# EAGLE design therma (EAGLE 9.1.0)
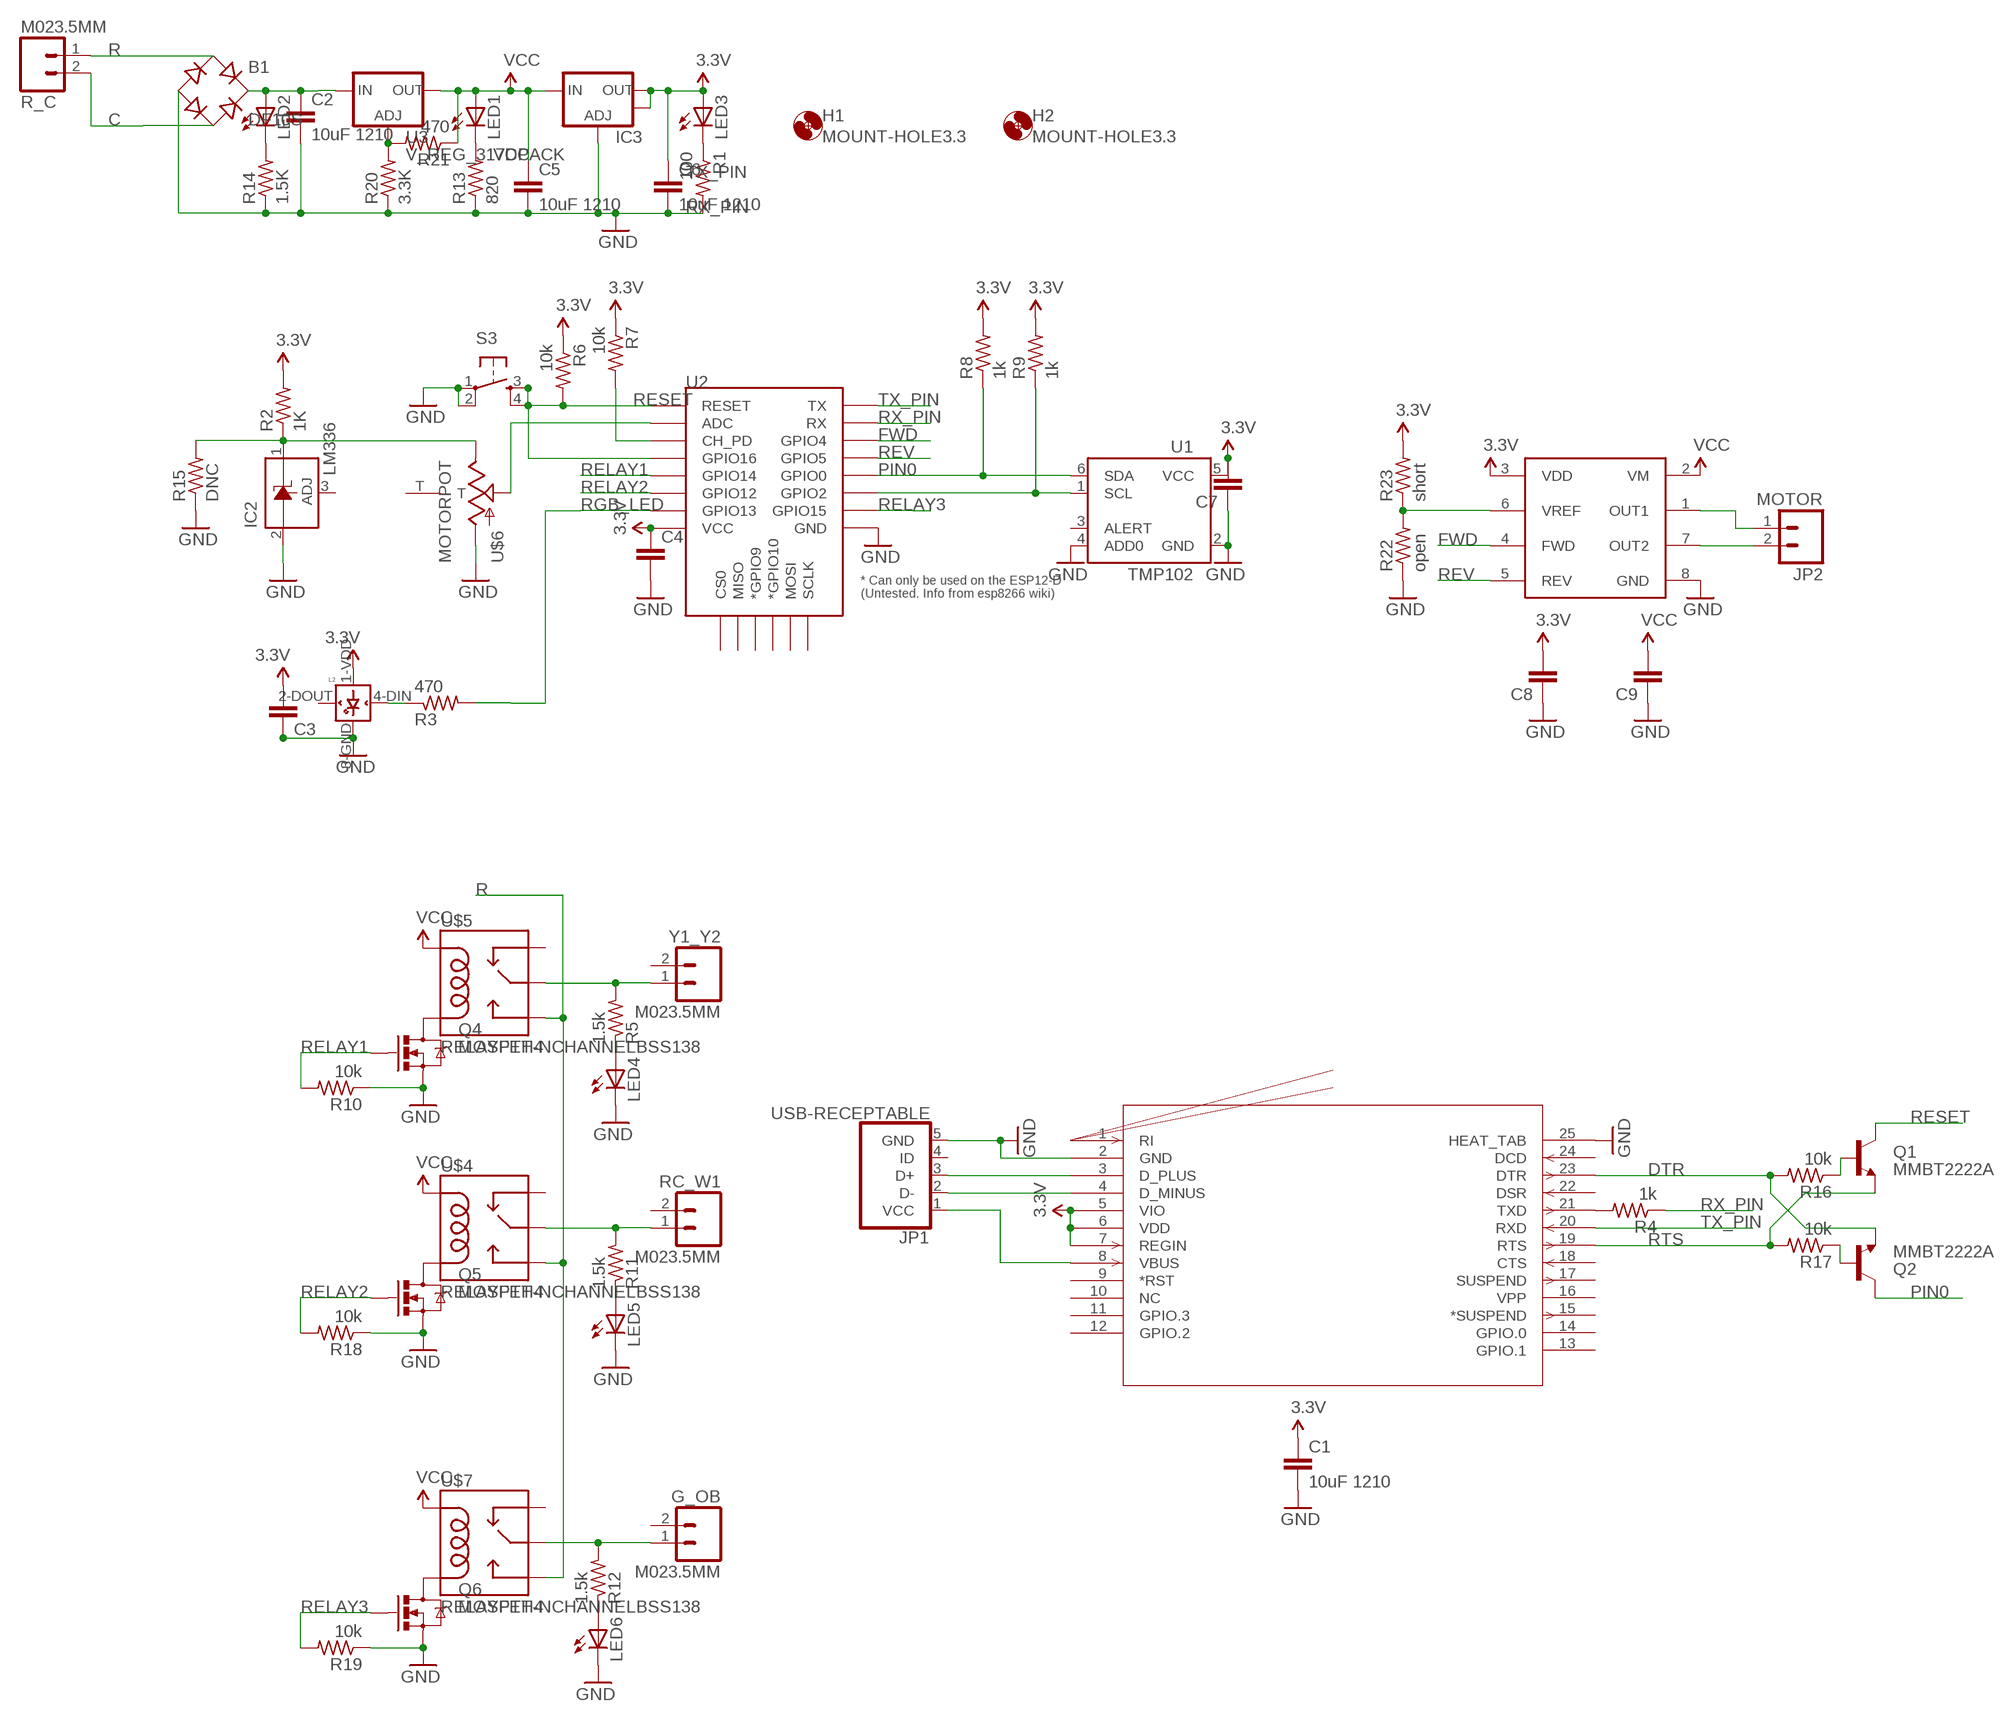
[diagram p0: schematic, sheet 1]

## Parts
B1  DF10S  [DFS]
C1  10uF 1210  10UF50V20%(1210)  [1210]
C2  10uF 1210  10UF50V20%(1210)  [1210]
C3  CAP0603-CAP  [0603-CAP]
C4  CAP0603-CAP  [0603-CAP]
C5  10uF 1210  10UF50V20%(1210)  [1210]
C6  10uF 1210  10UF50V20%(1210)  [1210]
C7  CAP0603-CAP  [0603-CAP]
C8  CAP0603-CAP  [0603-CAP]
C9  CAP0603-CAP  [0603-CAP]
G_OB  M023.5MM  [SCREWTERMINAL-3.5MM-2]
H1  MOUNT-HOLE3.3  [3,3]
H2  MOUNT-HOLE3.3  [3,3]
IC2  LM336  [SOT23-3]
IC3  V_REG_LM1117SOT223  [SOT223]
JP1  USB-RECEPTABLE  [FCI-10103594-0001LF]
JP2  MOTOR  M02PTH  [1X02]
L2  WS2812B  [WS2812B]
LED1  LEDCHIPLED_1206  [CHIPLED_1206]
LED2  LEDCHIPLED_1206  [CHIPLED_1206]
LED3  LEDCHIPLED_1206  [CHIPLED_1206]
LED4  LEDCHIPLED_1206  [CHIPLED_1206]
LED5  LEDCHIPLED_1206  [CHIPLED_1206]
LED6  LEDCHIPLED_1206  [CHIPLED_1206]
Q1  MMBT2222A  TRANSISTOR_NPNMMBT2222A  [SOT23]
Q2  MMBT2222A  TRANSISTOR_NPNMMBT2222A  [SOT23]
Q4  MOSFET-NCHANNELBSS138  [SOT23]
Q5  MOSFET-NCHANNELBSS138  [SOT23]
Q6  MOSFET-NCHANNELBSS138  [SOT23]
R1  100  R-US_R0603  [R0603]
R2  1K  R-US_R0603  [R0603]
R3  470  R-US_R0603  [R0603]
R4  1k  R-US_R0603  [R0603]
R5  1.5k  R-US_R0603  [R0603]
R6  10k  R-US_R0603  [R0603]
R7  10k  R-US_R0603  [R0603]
R8  1k  R-US_R0603  [R0603]
R9  1k  R-US_R0603  [R0603]
R10  10k  R-US_R0603  [R0603]
R11  1.5k  R-US_R0603  [R0603]
R12  1.5k  R-US_R0603  [R0603]
R13  820  R-US_R0603  [R0603]
R14  1.5K  R-US_R0603  [R0603]
R15  DNC  R-US_R0603  [R0603]
R16  10k  R-US_R0603  [R0603]
R17  10k  R-US_R0603  [R0603]
R18  10k  R-US_R0603  [R0603]
R19  10k  R-US_R0603  [R0603]
R20  3.3K  R-US_R0603  [R0603]
R21  470  R-US_R0603  [R0603]
R22  open  R-US_R0603  [R0603]
R23  short  R-US_R0603  [R0603]
R_C  M023.5MM  [SCREWTERMINAL-3.5MM-2]
RC_W1  M023.5MM  [SCREWTERMINAL-3.5MM-2]
S3  TAC_SWITCHSMD  [TACTILE_SWITCH_SMD]
U1  TMP102  [SOT563]
U2  ESP12ESMD  [ESP12E-SMD]
U3  V_REG_317DPACK  [V-REG_DPACK]
U$1  ZXBM5210SOIC  [SOIC8]
U$4  RELAYPTH4  [RELAY-JZC]
U$5  RELAYPTH4  [RELAY-JZC]
U$6  MOTORPOT  [MOTORIZEDPOT]
U$7  RELAYPTH4  [RELAY-JZC]
U$8  CP2104-GM  [QFN24_4X4]
Y1_Y2  M023.5MM  [SCREWTERMINAL-3.5MM-2]

## Nets
3.3V: C1.1 C3.2 C4.1 C6.1 C7.2 C8.2 IC3.2(OUT) IC3.4(OUT) L2.1-VDD(VDD) LED3.A R2.2 R6.1 R7.1 R8.2 R9.2 R23.2 U1.5(VCC) U2.VCC U$1.3(VDD) U$8.5(VIO) U$8.6(VDD) U$8.7(REGIN)
C: B1.AC2 R_C.2
DTR: Q2.2(E) R16.2 U$8.23(DTR)
FWD: U2.GPIO4 U$1.4(FWD)
GND: B1.- C1.2 C2.2 C3.1 C4.2 C5.2 C6.2 C7.1 C8.1 C9.1 IC2.2(A) IC3.1(ADJ) JP1.5(GND) L2.3-GND(GND) LED4.C LED5.C LED6.C Q4.2(S) Q5.2(S) Q6.2(S) R1.2 R10.1 R13.1 R14.1 R15.1 R18.1 R19.1 R20.1 R22.1 S3.1 S3.2 U1.2(GND) U1.4(ADD0) U2.GND U$1.8(GND) U$6.3' U$8.2(GND) U$8.25(HEAT_TAB)
N$1: Q4.3(D) U$5.1(COIL2)
N$2: R7.2 U2.CH_PD
N$3: R9.1 U1.1(SCL) U2.GPIO2
N$5: Q5.3(D) U$4.1(COIL2)
N$6: Q6.3(D) U$7.1(COIL2)
N$8: U2.ADC U$6.2'
N$9: LED4.A R5.1
N$10: LED3.C R1.1
N$11: L2.4-DIN(DIN) R3.1
N$12: JP1.1(VCC) U$8.8(VBUS)
N$14: JP1.2(D-) U$8.4(D_MINUS)
N$15: JP1.3(D+) U$8.3(D_PLUS)
N$16: Q1.1(B) R16.1
N$17: IC2.1(C) R2.1 R15.2 U$6.1'
N$18: R5.2 U$5.4(MAIN) Y1_Y2.1
N$19: G_OB.1 R12.2 U$7.4(MAIN)
N$20: R11.2 RC_W1.1 U$4.4(MAIN)
N$21: Q2.1(B) R17.1
N$22: LED5.A R11.1
N$23: LED6.A R12.1
N$24: R4.2 U$8.21(TXD)
N$25: R20.2 R21.2 U3.1(ADJ)
N$26: JP2.2 U$1.7(OUT2)
N$27: JP2.1 U$1.1(OUT1)
N$28: LED1.C R13.2
N$29: R22.2 R23.1 U$1.6(VREF)
N$30: B1.+ C2.1 LED2.A U3.3(IN)
N$32: LED2.C R14.2
PIN0: Q2.3(C) R8.1 U1.6(SDA) U2.GPIO0
R: B1.AC1 R_C.1 U$4.3(NO) U$5.3(NO) U$7.3(NO)
RELAY1: Q4.1(G) R10.2 U2.GPIO14
RELAY2: Q5.1(G) R18.2 U2.GPIO12
RELAY3: Q6.1(G) R19.2 U2.GPIO15
RESET: Q1.3(C) R6.2 S3.3 S3.4 U2.GPIO16 U2.RESET
REV: U2.GPIO5 U$1.5(REV)
RGB_LED: R3.2 U2.GPIO13
RTS: Q1.2(E) R17.2 U$8.19(RTS)
RX_PIN: R4.1 U2.RXD0(RX)
TX_PIN: U2.TXD0(TX) U$8.20(RXD)
VCC: C5.1 C9.2 IC3.3(IN) LED1.A R21.1 U3.4(OUT) U$1.2(VM) U$4.5(COIL1) U$5.5(COIL1) U$7.5(COIL1)
Unconnected: G_OB.2 IC2.3(ADJ) JP1.4(ID) L2.2-DOUT(DOUT) RC_W1.2 U1.3(ALERT) U2.CS0 U2.GPIO9(*GPIO9) U2.GPIO10(*GPIO10) U2.MISO U2.MOSI U2.SCLK U$4.2(NC) U$5.2(NC) U$6.T U$7.2(NC) U$8.1(RI) U$8.9(*RST) U$8.10(NC) U$8.11(GPIO.3) U$8.12(GPIO.2) U$8.13(GPIO.1) U$8.14(GPIO.0) U$8.15(*SUSPEND) U$8.16(VPP) U$8.17(SUSPEND) U$8.18(CTS) U$8.22(DSR) U$8.24(DCD) Y1_Y2.2

## Library data of the parts
B1 = rectifier:DF*S: Surface Mount Glass Passivated Bridge Rectifiers Source: Source: Comchip Bridge Rectifiers DF005S-G thru DF10S-G.pdf
C1 C2 C5 C6 = SparkFun-Capacitors:10UF50V20%(1210): CAP-09824; PROD_ID: CAP-09824; VALUE: 10uF
C3 C4 C7-C9 = SparkFun-Passives:CAP: Capacitor Standard 0603 ceramic capacitor, and 0.1" leaded capacitor.
G_OB JP2 R_C RC_W1 Y1_Y2 = SparkFun-Connectors:M02: Standard 2-pin 0.1" header. Use with - straight break away headers ( PRT-00116) - right angle break away headers (PRT-00553) - swiss pins (PRT-00743) - machine pins (PRT-00117) - female headers (PRT-00115) Molex polarized connector foot print use with: PRT-08233 with associated crimp pins and housings. 2.54_SCREWTERM for use with PRT-10571. 3.5mm Screw Terminal footprints for PRT-08084 5mm Screw Terminal footprints for use with PRT-08433
H1 H2 = holes:MOUNT-HOLE: MOUNTING HOLE with drill center marker
IC2 = sonik:LM336: 2.5-V INTEGRATED REFERENCE CIRCUITS LM236 Source: http://focus.ti.com/lit/ds/symlink/lm336-2.5.pdf
IC3 = SparkFun-PowerIC:V_REG_LM1117: Voltage Regulator LM1117 Standard adjustable voltage regulator but in SMD form. Spark Fun Electronics SKU : COM-00595
JP1 = daspilker:USB-RECEPTABLE: USB Receptable
L2 = adafruit:WS2812B
LED1-LED6 = adafruit:LED: LED OSRAM: - CHIPLED LG R971, LG N971, LY N971, LG Q971, LY Q971, LO R971, LY R971 LH N974, LH R974 LS Q976, LO Q976, LY Q976 LO Q996 - Hyper CHIPLED LW Q18S LB Q993, LB Q99A, LB R99A - SideLED LS A670, LO A670, LY A670, LG A670, LP A670 LB A673, LV A673, LT A673, LW A673 LH A674 LY A675 LS A676, LA A676, LO A676, LY A676, LW A676 LS A679, LY A679, LG A679 - Hyper Micro SIDELED® LS Y876, LA Y876, LO Y876, LY Y876 LT Y87S - SmartLED LW L88C, LW L88S LB L89C, LB L89S, LG L890 LS L89K, LO L89K, LY L89K LS L896, LA L896, LO L896, LY L896 - TOPLED LS T670, LO T670, LY T670, LG T670, LP T670 LSG T670, LSP T670, LSY T670, LOP T670, LYG T670 LG T671, LOG T671, LSG T671 LB T673, LV T673, LT T673, LW T673 LH T674 LS T676, LA T676, LO T676, LY T676, LB T676, LH T676, LSB T676, LW T676 LB T67C, LV T67C, LT T67C, LS T67K, LO T67K, LY T67K, LW E67C LS E67B, LA E67B, LO E67B, LY E67B, LB E67C, LV E67C, LT E67C LW T67C LS T679, LY T679, LG T679 LS T770, LO T770, LY T770, LG T770, LP T770 LB T773, LV T773, LT T773, LW T773 LH T774 LS E675, LA E675, LY E675, LS T675 LS T776, LA T776, LO T776, LY T776, LB T776 LHGB T686 LT T68C, LB T68C - Hyper Mini TOPLED® LB M676 - Mini TOPLED Santana® LG M470 LS M47K, LO M47K, LY M47K Source: http://www.osram.convergy.de/
Q1 Q2 = SparkFun-DiscreteSemi:TRANSISTOR_NPN: Generic NPN BJT MMBT2222A - TRANS-08049 (SOT-23, 1A 40V) MPSA42 - TRANS-09116 (SOT-23, 500mA 300V) MMBT5088LT1G - TRANS-11160 (SOT-23, 50 mA 30V); PROD_ID: TRANS-08049
Q4-Q6 = SparkFun-DiscreteSemi:MOSFET-NCHANNEL: Common NMOSFET Parts MFG P/N Store ID Prod ID FDD8780 TRANS-09984 SI7820DN TRANS-11055 FDS6630A IC-08089 2N7002PW TRANS-11151 FQP30N06L COM-10213 TRANS-10060 BSS123LT1G TRANS-08345 BSS138 TRANS-00830 BS170 2N7000; PROD_ID: TRANS-00830
R1-R23 = adafruit:R-US_: RESISTOR, American symbol
S3 = SparkFun-Electromechanical:TAC_SWITCH: Momentary Switch Button commonly used for reset or general input. Spark Fun Electronics SKU : COM-00097 SMT- SWCH-08247; PROD_ID: SWCH-08247
U1 = SparkFun-Sensors:TMP102: I2C degC temp sensor
U2 = esp8266modules:ESP12E: ESP12E Module
U3 = SparkFun-PowerIC:V_REG_317: Voltage Regulator Standard LM317 adjustable voltage regulator. AOI (Adjust Output Input). Google 'LM317 Calculator' for easy to use app to get the two resistor values needed. 240/720 for 5V output. 240/390 for 3.3V output. Spark Fun Electronics SKU : COM-00527
U$1 = sonik:ZXBM5210
U$4 U$5 U$7 = SparkFun-Electromechanical:RELAY: SPDT relay (COM-00101)
U$6 = sonik:MOTORPOT
U$8 = cp2104:CP2104-GM

## Board
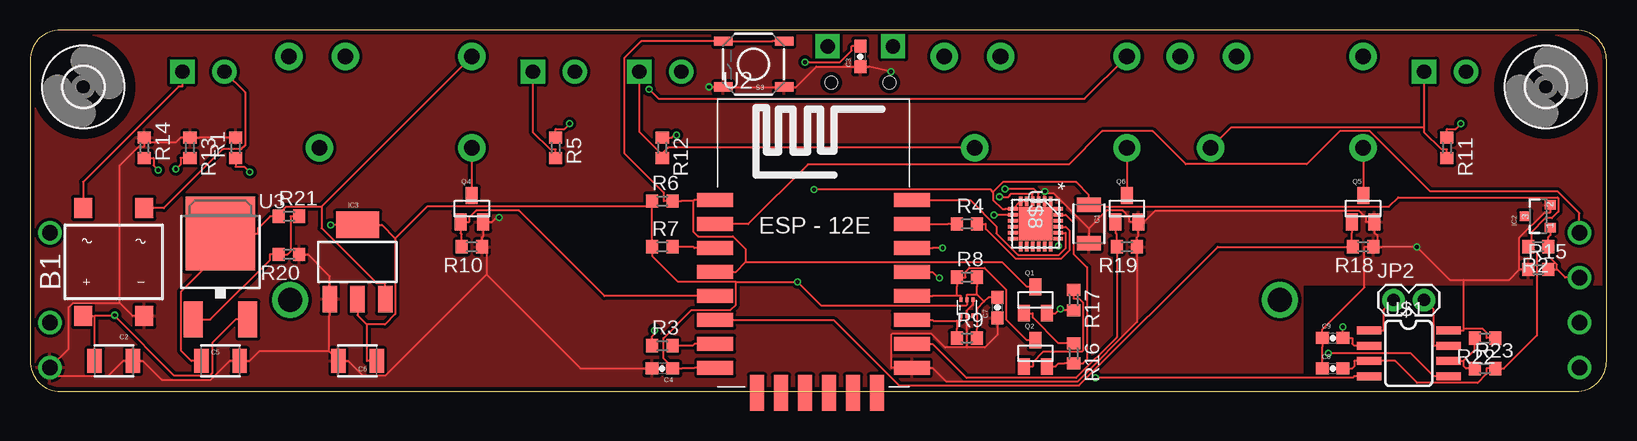
[diagram p1: board, top side]
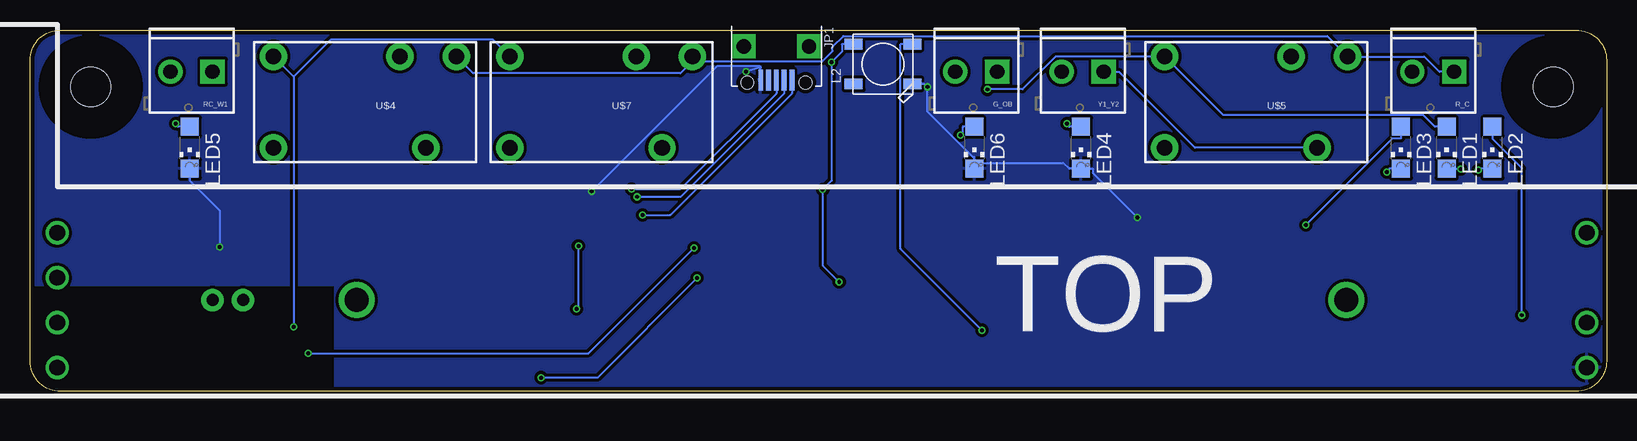
[diagram p2: board, bottom side, seen from below]

Size 131.43 x 30.15 mm. Coordinates in mm from the lower left corner, seen from the top.
Outline: 0,27.61 0,2.54 arc90 2.54,0 128.88,0 arc90 131.43,2.54 131.43,27.61 arc90 128.88,30.15 2.54,30.15 arc90 0,27.61
Copper layers (1*16): Top 0.0356mm / dielectric 1.5011mm / Bottom 0.0356mm
Design rules "OSHparkDruTented *": minimum track width 6mil, minimum drill 13mil, track to track 6mil, track to pad 6mil, pad to pad 6mil, via to via 6mil, smd to smd 5mil, copper to edge 14mil, drill to drill 6mil, minimum pad ring 5mil, minimum via ring 5mil, stop-mask expansion 3mil, vias tented up to drill 14mil, thermal gap 10mil

### Footprints (pad centres in the part's own frame; a part is rotated, then mirrored left to right if it is on the bottom)
DFS = smd 1.5 x 1.7: + -2.55,-4.5; - 2.55,-4.5; AC1 -2.55,4.5; AC2 2.55,4.5
1210 = smd 1.2 x 2: 1 -1.6,0; 2 1.6,0
0603-CAP = smd 1.1 x 1: 1 -0.85,0; 2 0.85,0
SCREWTERMINAL-3.5MM-2 = drill 1.2 pad 2.032 square: 1 0,0 | drill 1.2 pad 2.032: 2 3.5,0
3,3 = hole 3.3: 0,0
SOT23-3 = smd 0.8 x 0.9: 1 -0.95,-1; 2 0.95,-1; 3 0,1.1
SOT223 = smd 1.219 x 2.235: 1 -2.311,-3.099; 2 0,-3.099; 3 2.311,-3.099 | smd 3.6 x 2.2: 4 0,3.099
FCI-10103594-0001LF = smd 0.4 x 1.75: 1 -1.3,4.525; 2 -0.65,4.525; 3 0,4.525; 4 0.65,4.525; 5 1.3,4.525 | drill 1.2 pad 2 square: P$3 -2.725,1.7; P$4 2.725,1.7 | hole 1.05: -2.425,4.73; 2.425,4.73
1X02 = drill 1.016 pad 1.88: 1 0,0; 2 2.54,0
WS2812B = smd 1.5 x 0.9: 1-VDD 2.45,-1.65; 2-DOUT 2.45,1.65; 3-GND -2.45,1.65; 4-DIN -2.45,-1.65
CHIPLED_1206 = smd 1.5 x 1.5: A 0,-1.75; C 0,1.75
SOT23 = smd 1 x 1.4: 1 -0.95,-1.1; 2 0.95,-1.1; 3 0,1.1
R0603 = smd 1 x 1.1: 1 -0.85,0; 2 0.85,0
TACTILE_SWITCH_SMD = smd 1.524 x 0.762: 1 -2.54,1.905; 2 2.54,1.905; 3 -2.54,-1.905; 4 2.54,-1.905
SOT563 = smd 0.25 x 0.4: 1 -0.5,-0.66; 2 0,-0.66; 3 0.5,-0.66; 4 0.5,0.66; 5 0,0.66; 6 -0.5,0.67
ESP12E-SMD = smd 3 x 1.2: ADC -8.3,3.8; CH_PD -8.3,1.8; GND 8.1,-8.2; GPIO0 8.1,-2.2; GPIO2 8.1,-4.2; GPIO4 8.1,-0.2; GPIO5 8.1,1.8; GPIO12 -8.3,-4.2; GPIO13 -8.3,-6.2; GPIO14 -8.3,-2.2; GPIO15 8.1,-6.2; GPIO16 -8.3,-0.2; RESET -8.3,5.8; RXD0 8.1,3.8; TXD0 8.1,5.8; VCC -8.3,-8.2 | smd 1.2 x 3: CS0 -4.8,-10.3; GPIO9 -0.8,-10.3; GPIO10 1.2,-10.3; MISO -2.8,-10.3; MOSI 3.2,-10.3; SCLK 5.2,-10.3
V-REG_DPACK = smd 1.6 x 3: 1 -2.28,-4.8; 3 2.28,-4.8 | smd 5.8 x 6.2: 4 0,2.38
SOIC8 = smd 0.66 x 2.032: 1 -1.905,-3.315; 2 -0.635,-3.315; 3 0.635,-3.315; 4 1.905,-3.315; 5 1.905,3.315; 6 0.635,3.315; 7 -0.635,3.315; 8 -1.905,3.315
RELAY-JZC = drill 1.3 pad 2.286: 1 3.81,-8.89; 2 -3.81,1.651; 3 -3.81,6.35; 4 3.81,3.81; 5 -3.81,-8.89
MOTORIZEDPOT = drill 1.3: 1 63.75,1.875; 1' 63.75,-1.875; 2 63.75,5.625; 2' 63.75,-5.625; 3 -63.75,-5.625; 3' -63.75,5.625; T -63.75,1.875 | drill 2: P$1 -43.7,0; P$2 38.8,0
QFN24_4X4 = smd 0.813 x 0.305: 1 -1.892,1.25; 2 -1.892,0.75; 3 -1.892,0.25; 4 -1.892,-0.25; 5 -1.892,-0.75; 6 -1.892,-1.25; 13 1.892,-1.25; 14 1.892,-0.75; 15 1.892,-0.25; 16 1.892,0.25; 17 1.892,0.75; 18 1.892,1.25 | smd 0.305 x 0.813: 7 -1.25,-1.892; 8 -0.75,-1.892; 9 -0.25,-1.892; 10 0.25,-1.892; 11 0.75,-1.892; 12 1.25,-1.892; 19 1.25,1.892; 20 0.75,1.892; 21 0.25,1.892; 22 -0.25,1.892; 23 -0.75,1.892; 24 -1.25,1.892 | smd 2.794 x 2.794: 25 0,0

### Placement (x,y rotation side)
B1  6.98,10.79 0 top
C1  88.27,13.97 270 top
C2  6.98,2.54 0 top
C3  69.22,27.94 90 top
C4  52.7,1.91 180 top
C5  15.88,2.54 0 top
C6  27.3,2.54 180 top
C7  80.64,6.99 90 top
C8  108.59,1.91 0 top
C9  108.59,4.45 0 top
G_OB  50.8,26.67 180 bottom
H1  4.44,25.4 0 top
H2  126.36,25.4 0 top
IC2  125.73,14.61 90 top
IC3  27.3,10.79 0 top
JP1  69.22,30.48 180 bottom
JP2  113.66,7.62 0 top
L2  60.32,27.3 180 bottom
LED1  13.34,20.32 180 bottom
LED2  9.52,20.32 180 bottom
LED3  17.14,20.32 180 bottom
LED4  43.81,20.32 180 bottom
LED5  118.11,20.32 180 bottom
LED6  52.7,20.32 180 bottom
Q1  83.82,7.62 0 top
Q2  83.82,3.17 0 top
Q4  36.83,15.24 0 top
Q5  111.12,15.24 0 top
Q6  91.44,15.24 0 top
R1  17.14,20.32 90 top
R2  125.73,12.06 180 top
R3  52.7,3.81 0 top
R4  78.11,13.97 0 top
R5  43.81,20.32 270 top
R6  52.7,15.88 0 top
R7  52.7,12.06 0 top
R8  78.11,9.53 0 top
R9  78.11,4.45 0 top
R10  36.83,12.06 180 top
R11  118.11,20.32 270 top
R12  52.7,20.32 270 top
R13  13.34,20.32 270 top
R14  9.52,20.32 270 top
R15  125.73,10.16 0 top
R16  87,3.17 270 top
R17  87,7.62 270 top
R18  111.12,12.06 180 top
R19  91.44,12.06 180 top
R20  21.59,11.43 180 top
R21  21.59,14.61 0 top
R22  121.28,4.45 180 top
R23  121.28,1.91 0 top
R_C  12.7,26.67 180 bottom
RC_W1  116.2,26.67 180 bottom
S3  60.32,27.3 180 top
U1  78.11,6.99 0 top
U2  65.41,10.16 0 top
U3  15.88,10.79 0 top
U$1  114.94,3.17 270 top
U$4  102.23,24.13 270 bottom
U$5  27.94,24.13 270 bottom
U$6  65.41,7.62 180 bottom
U$7  82.55,24.13 270 bottom
U$8  83.82,13.97 270 top
Y1_Y2  41.91,26.67 180 bottom

### Tracks (layer width: path | path; a pad name or v marks a point on that pad's centre or on a via)
3.3V  (via drill 0.33 pad 0.58)
  Top 0.152: 58.83,9.13 v63.97,9.13 65.97,7.13 78.02,7.13 78.11,7.22 78.11,7.43 U1.5 78.11,8.07 78.95,8.07 | 80.28,16.63 80.08,16.82 v65.34,16.82 | 51.85,15.41 R7.1 51.85,11.29 54.01,9.13 58.83,9.13 | 80.28,16.63 80.28,15.98 81.04,15.22 81.29,15.22 U$8.7 U$8.6 U$8.5 | 80.28,16.63 81.1,17.45 87.22,17.45 88.27,16.4 C1.1 89.49,15.57 89.65,15.41 113.27,15.41 114.05,16.18 127.34,16.18 127.41,16.11 127.41,15 126.86,14.45 126.31,14.45 125.13,13.27 125.13,12.06 | 53.66,1.91 52.8,2.76 52.8,4.43 55.16,6.79 58.39,6.79 58.83,7.23 58.83,9.13 | 53.66,1.91 53.76,1.91 53.94,1.91 54.33,1.91 54.39,1.96 55.38,1.96 56.24,1.96 U2.VCC | C4.1 53.66,1.91 | 51.85,15.41 R6.1 | 51.85,15.41 33.09,15.41 30.45,12.77 | 30.45,12.77 30.45,6.45 29.59,5.58 28.08,5.58 | 30.45,12.77 29.33,13.89 IC3.4 v25.07,13.89 | 28.08,5.58 28.08,2.54 C6.1 | 28.08,5.58 27.3,6.35 IC3.2 | C8.2 110.21,1.91 110.38,2.07 110.38,2.54 U$1.3 113.8,2.54 115.62,0.71 120.67,0.71 121.41,1.45 121.41,1.91 R23.2 122.86,1.91 125.61,4.65 125.61,11.59 125.13,12.06 | 79.54,7.49 79.88,7.83 79.92,7.83 C7.2 | 79.54,7.49 78.96,6.91 78.96,5.23 78.95,5.22 R9.2 | 78.95,8.07 79.54,7.49 | 78.95,8.07 78.95,8.75 R8.2 | R2.2 125.13,12.06 | C3.2 68.49,28.79 68.49,28.43 67.54,27.48 v64.6,27.48
  Bottom 0.152: v63.97,9.13 65.34,10.51 v65.34,16.82 64.6,17.57 v64.6,27.48 63.75,28.32 63.75,28.95 L2.1-VDD | v25.07,13.89 17.87,21.09 17.14,21.09 LED3.A
C
  Top 0.152: R_C.2 17.92,24.95 17.92,20.51 17.61,20.2 16.07,20.2 11.17,15.29 B1.AC2
DTR
  Top 0.152: U$8.23 86.35,14.72 87,14.07 87,11.45 88.11,10.34 88.11,2.66 87.77,2.33 R16.2 86.96,2.33 86.22,2.33 85.75,2.33 85.5,2.08 Q2.2
FWD  (via drill 0.33 pad 0.58)
  Top 0.152: U2.GPIO4 75.23,9.96 75.75,9.45 v75.82,9.45 | v88.83,1.15 110.25,1.15 110.38,1.27 U$1.4
  Bottom 0.152: v75.82,9.45 84.12,1.15 v88.83,1.15
GND  (via drill 0.33 pad 0.58)
  Top 0.152: 84.6,16.5 84.57,16.5 U$8.2 84.57,14.72 U$8.25 | 88.27,13.6 85.37,16.5 84.6,16.5 | 84.6,16.5 v84.6,16.69 | U1.4 78.61,7.22 78.57,7.22 78.11,6.75 U1.2 78.11,3.67 | 92.39,13.68 92.39,12.94 92.29,12.84 R19.1 92.29,5.78 87.31,0.8 76.39,0.8 75.23,1.96 U2.GND 71.78,1.96 71.78,4.72 71.84,4.79 75.16,4.79 76.29,3.67 78.11,3.67 | 92.39,13.68 93.8,15.09 110.76,15.09 111.35,14.5 111.35,14.14 Q5.2 112.07,13.21 112.34,12.95 112.34,12.06 | 92.39,13.68 Q6.2 91.66,14.14 91.66,14.5 91.1,15.07 89.73,15.07 88.27,13.6 | 88.27,13.6 C1.2 | C8.1 107.73,2.63 107.7,2.67 107.7,3.69 107.73,3.72 C9.1 107.73,5.17 111.25,8.69 111.25,12.06 R18.1 112.34,12.06 | 124.15,10.16 124.15,12.82 126.25,14.93 126.73,14.93 IC2.2 | 119.49,9.3 123.3,9.3 124.15,10.16 | 119.49,9.3 118.36,9.3 v115.6,12.06 112.7,12.06 112.34,12.06 | 119.49,9.3 119.49,5.25 | R15.1 124.15,10.16 | 119.49,5.25 119.49,5.08 U$1.8 | 119.49,5.25 121.06,5.25 121.41,4.9 121.41,4.45 R22.1 | C7.1 80.64,4.72 79.59,3.67 78.11,3.67 | 38.04,9.75 45.89,1.91 C4.2 | v56.6,25.4 56.79,25.4 S3.2 S3.1 63.86,25.4 65.55,27.09 C3.1 69.94,27.09 v71.75,26.67 | 9.52,20.81 12.19,20.81 12.56,21.17 R13.1 14.11,21.17 R1.2 | 9.52,20.81 9.52,20.44 9.07,20.44 7.48,18.85 7.48,7.37 | R14.1 9.52,20.81 | 7.48,7.37 8.56,6.29 B1.- | 7.48,7.37 3.59,7.37 3.22,7.01 3.22,3.56 U$6.3' 2.34,1.31 6.53,1.31 7.76,2.54 C2.2 9.41,2.54 10.99,0.96 15.07,0.96 16.65,2.54 C5.2 18.3,2.54 19.09,3.33 24.92,3.33 | 38.04,9.75 29.61,1.31 27.76,1.31 26.53,2.54 C6.2 24.92,3.33 | 38.04,9.75 38.04,12.06 R10.1 37.68,12.84 37.78,12.94 Q4.2 38.14,14.14 38.51,14.14 38.88,14.52 v39.12,14.52
  Top 0.152: 24.92,3.33 24.92,6.27 24.99,6.35 IC3.1 24.99,9.04 24.99,9.61 23.17,11.43 R20.1
  Bottom 0.152: 70.52,27.06 70.61,27.15 74.14,27.15 v84.6,16.69 | 52.7,19.06 45.28,19.06 44.79,18.57 LED4.C 43.33,18.57 42.84,18.57 42.84,18.23 v39.12,14.52 | 52.7,19.06 52.7,19.55 52.83,19.55 56.6,23.32 v56.6,25.4 56.64,25.4 56.9,25.66 L2.3-GND | LED6.C 52.7,19.06 | 70.52,27.06 70.5,27.06 v71.75,26.67 | v115.6,12.06 115.6,15.08 118.11,17.59 LED5.C | JP1.5 70.52,27.06
  pour Top (isolate 0.254): 0.63,30.48 131.44,30.48 131.44,8.89 106.05,8.89 106.05,0 -0.64,0 -0.64,30.48
  pour Bottom (isolate 0.254): 0.63,30.48 131.44,30.48 131.44,8.89 106.05,8.89 106.05,0 -0.64,0 -0.64,30.48
N$1
  Top 0.152: U$5.1 Q4.3
N$2
  Top 0.152: U2.CH_PD 55.38,11.96 55.27,12.06 R7.2
N$3
  Top 0.152: 77.25,5.9 77.61,5.9 U1.1 | 77.25,5.9 75.3,5.9 75.23,5.96 U2.GPIO2 | 77.25,5.9 77.25,5.22 R9.1
N$5
  Top 0.152: U$4.1 Q5.3
N$6
  Top 0.152: U$7.1 Q6.3
N$8
  Top 0.152: U$6.2' 129.16,14.87 127.34,16.68 116.72,16.68 111.69,21.71 109.17,21.71 106.42,18.95 96.35,18.95 93.6,21.7 89.36,21.7 86.61,18.94 64.85,18.94 59.87,13.96 U2.ADC
N$9  (via drill 0.33 pad 0.58)
  Top 0.152: v44.99,22.34 44.54,21.9 43.81,21.9 R5.1
  Bottom 0.152: v44.99,22.34 44.79,22.15 44.79,22.07 LED4.A
N$10  (via drill 0.33 pad 0.58)
  Top 0.152: R1.1 17.14,18.74 17.87,18.74 v18.33,18.29
  Bottom 0.152: v18.33,18.29 18.12,18.49 18.12,18.57 LED3.C
N$11  (via drill 0.33 pad 0.58)
  Top 0.152: R3.1 51.85,4.59 52.08,4.81 v52.08,5.11
  Bottom 0.152: L2.4-DIN 58.85,28.95 58.85,11.88 v52.08,5.11
N$12  (via drill 0.33 pad 0.58)
  Top 0.152: U$8.8 v80.35,14.72
  Bottom 0.152: v80.35,14.72 78.05,14.72 67.91,24.85 JP1.1
N$14  (via drill 0.33 pad 0.58)
  Top 0.152: v80.81,16.23 81.55,16.23 81.81,16.5 83.57,16.5 U$8.4
  Bottom 0.152: v80.81,16.23 77.18,16.23 68.56,24.85 JP1.2
N$15  (via drill 0.33 pad 0.58)
  Top 0.152: U$8.3 84.07,16.5 83.69,16.88 v81.27,16.88
  Bottom 0.152: JP1.3 69.22,24.85 77.18,16.88 v81.27,16.88
N$16
  Top 0.152: Q1.1 83.6,6.52 83.6,6.16 85.73,4.03 R16.1
N$17
  Top 0.152: 127.28,10.16 127.28,10.59 126.58,11.29 R2.1 126.58,12.88 126.73,13.03 IC2.1 | 127.28,10.16 127.31,10.16 127.97,9.49 U$6.1' | R15.2 127.28,10.16
N$18
  Top 0.152: R5.2 43.81,20.2 43.36,20.2 41.91,21.65 Y1_Y2.1
  Bottom 0.152: Y1_Y2.1 40.66,26.67 34.31,20.32 U$5.4
N$19
  Top 0.152: U$7.4 53.19,20.32 52.7,19.83 | 52.7,19.83 52.61,19.83 50.8,21.64 G_OB.1 | R12.2 52.7,19.83
N$20
  Top 0.152: 116.2,22.01 116.2,21.65 117.66,20.2 118.11,20.2 R11.2 | RC_W1.1 116.2,22.01 | 116.2,22.01 100.12,22.01 U$4.4
N$21
  Top 0.152: Q2.1 83.6,2.08 83.6,2.44 84.46,3.3 87.68,3.3 87.77,3.39 87.77,7.42 87.45,7.74 87,7.74 R17.1
N$22  (via drill 0.33 pad 0.58)
  Top 0.152: v119.28,22.34 118.84,21.9 118.11,21.9 R11.1
  Bottom 0.152: v119.28,22.34 119.09,22.15 119.09,22.07 LED5.A
N$23  (via drill 0.33 pad 0.58)
  Top 0.152: v53.88,21.38 53.69,21.38 53.48,21.17 R12.1
  Bottom 0.152: v53.88,21.38 53.68,21.57 53.68,22.07 LED6.A
N$24
  Top 0.152: R4.2 79.68,13.97 79.68,13.54 82.17,11.05 85.94,11.05 86.65,11.77 86.65,13.41 86.35,13.72 U$8.21
N$25
  Top 0.152: U3.1 15.03,6 20.01,10.97 20.01,11.43 R20.2 21.47,11.43 21.71,11.67 21.71,14.61 R21.2
N$26
  Top 0.152: U$1.7 117,3.81 117,6.82 JP2.2
N$27
  Top 0.152: U$1.1 112.86,5.08 112.86,6.82 JP2.1
N$28  (via drill 0.33 pad 0.58)
  Top 0.152: R13.2 12.56,19.47 12.56,18.92 v12.17,18.53
  Bottom 0.152: LED1.C 12.36,18.57 12.32,18.53 v12.17,18.53
N$29
  Top 0.152: 119.49,2.54 120.44,3.48 R22.2 | 119.49,2.54 119.42,2.54 U$1.6 | R23.1 119.71,1.91 119.49,2.12 119.49,2.54
N$30  (via drill 0.33 pad 0.58)
  Top 0.152: C2.1 5.38,3.77 5.41,3.8 5.41,6.29 | 7.05,6.29 v7.05,6.36 | 7.05,6.29 12.03,1.31 14.97,1.31 15.19,1.53 15.19,4.06 17.13,6 U3.3 | 7.05,6.29 5.41,6.29 | B1.+ 5.41,6.29
  Bottom 0.152: LED2.A 9.52,21.09 7.05,18.62 v7.05,6.36
N$32  (via drill 0.33 pad 0.58)
  Top 0.152: R14.2 10.3,19.47 10.3,18.84 v10.69,18.45
  Bottom 0.152: LED2.C 10.5,18.57 10.62,18.45 v10.69,18.45
PIN0
  Top 0.152: Q2.3 83.09,4.28 81.37,5.99 81.37,8.5 79.57,10.3 78.31,10.3 77.98,9.98 77.98,9.53 R8.1 77.25,9.5 77.25,8.75 77.25,7.97 | 77.25,7.97 75.24,7.97 75.23,7.96 U2.GPIO0 | 77.25,7.97 77.57,7.97 77.61,7.94 U1.6
R
  Top 0.152: R_C.1 12.7,25.43 12.39,25.43 4.44,17.47 B1.AC1
  Bottom 0.152: 76.2,27.54 65.36,27.54 64.53,28.38 64.53,28.74 63.63,29.63 23.28,29.63 U$5.3 15.21,27.94 13.95,26.67 R_C.1 | U$7.3 76.2,27.54 | 76.2,27.54 77.21,26.53 94.48,26.53 U$4.3
RELAY1
  Top 0.152: U2.GPIO14 47.88,7.96 40.75,15.09 37.19,15.09 36.61,14.5 36.61,14.14 Q4.1 35.88,13.21 35.98,13.11 R10.2
RELAY2
  Top 0.152: U2.GPIO12 66.96,5.96 72.42,0.5 87.44,0.5 99.01,12.06 R18.2 110.28,12.45 110.17,12.55 110.17,13.21 Q5.1
RELAY3
  Top 0.152: Q6.1 90.49,13.21 90.59,13.11 R19.2 90.59,4.51 87.2,1.12 78.07,1.12 75.23,3.96 U2.GPIO15
RESET
  Top 0.152: 59.66,10.79 81.02,10.79 83.09,8.72 Q1.3 | 59.66,10.79 58.83,9.96 U2.GPIO16 | 55.29,15.88 55.29,13.35 55.7,12.94 58.59,12.94 59.66,11.87 59.66,10.79 | 55.29,15.88 54.28,15.88 R6.2 52.83,15.88 52.83,16.6 49.53,19.9 49.53,27.79 50.95,29.21 S3.4 58.28,29.21 58.78,29.21 61.87,29.21 S3.3 | 55.29,15.88 55.38,15.96 U2.RESET
REV  (via drill 0.33 pad 0.58)
  Top 0.152: U$1.5 117,1.27 115.1,3.17 v108.22,3.17 | U2.GPIO5 75.23,11.96 v76.08,11.96
  Bottom 0.152: v108.22,3.17 84.87,3.17 v76.08,11.96
RGB_LED
  Top 0.152: U2.GPIO13 55.38,3.96 55.23,3.81 R3.2
RTS  (via drill 0.33 pad 0.58)
  Top 0.152: U$8.19 v85.71,12.13 | Q1.2 85.5,6.52 85.85,6.88 v85.88,6.88 86.11,6.88 86.22,6.77 R17.2
  Bottom 0.152: v85.88,6.88 85.71,7.04 v85.71,12.13
RX_PIN
  Top 0.152: R4.1 76.53,13.97 76.52,13.96 U2.RXD0
TX_PIN
  Top 0.152: U2.TXD0 75.23,15.96 78.38,15.96 80.56,13.77 80.56,13.18 82.36,11.38 85.78,11.38 86.35,11.95 86.35,13.22 U$8.20
VCC  (via drill 0.33 pad 0.58)
  Top 0.152: 24.31,15.42 U$5.5 | 20.56,14.61 21.37,15.42 24.31,15.42 | 24.31,15.42 24.31,13.62 28.88,9.04 29.62,9.04 IC3.3 | v109.44,5.37 109.44,5.17 C9.2 110.21,4.45 110.21,3.97 110.38,3.81 U$1.2 | v51.61,25.19 52.4,24.41 87.91,24.41 U$7.5 | 20.56,14.61 20.01,14.61 19,13.6 19,13.18 17.44,13.18 | R21.1 20.56,14.61 | C5.1 13.45,2.54 12.57,3.42 12.57,8.3 17.44,13.18 | U3.4 17.44,13.18
  Bottom 0.152: 109.44,26.25 v109.44,5.37 | 36.83,27.91 U$5.5 | 36.83,27.91 31.96,23.05 15.29,23.05 14.31,22.07 LED1.A | 36.83,27.91 45.96,27.91 48.68,25.19 v51.61,25.19 | U$4.5 109.44,26.25 | U$7.5 92.84,29.34 106.34,29.34 109.44,26.25